# EAGLE design SLG46826G-breakout (EAGLE 9.6.2)
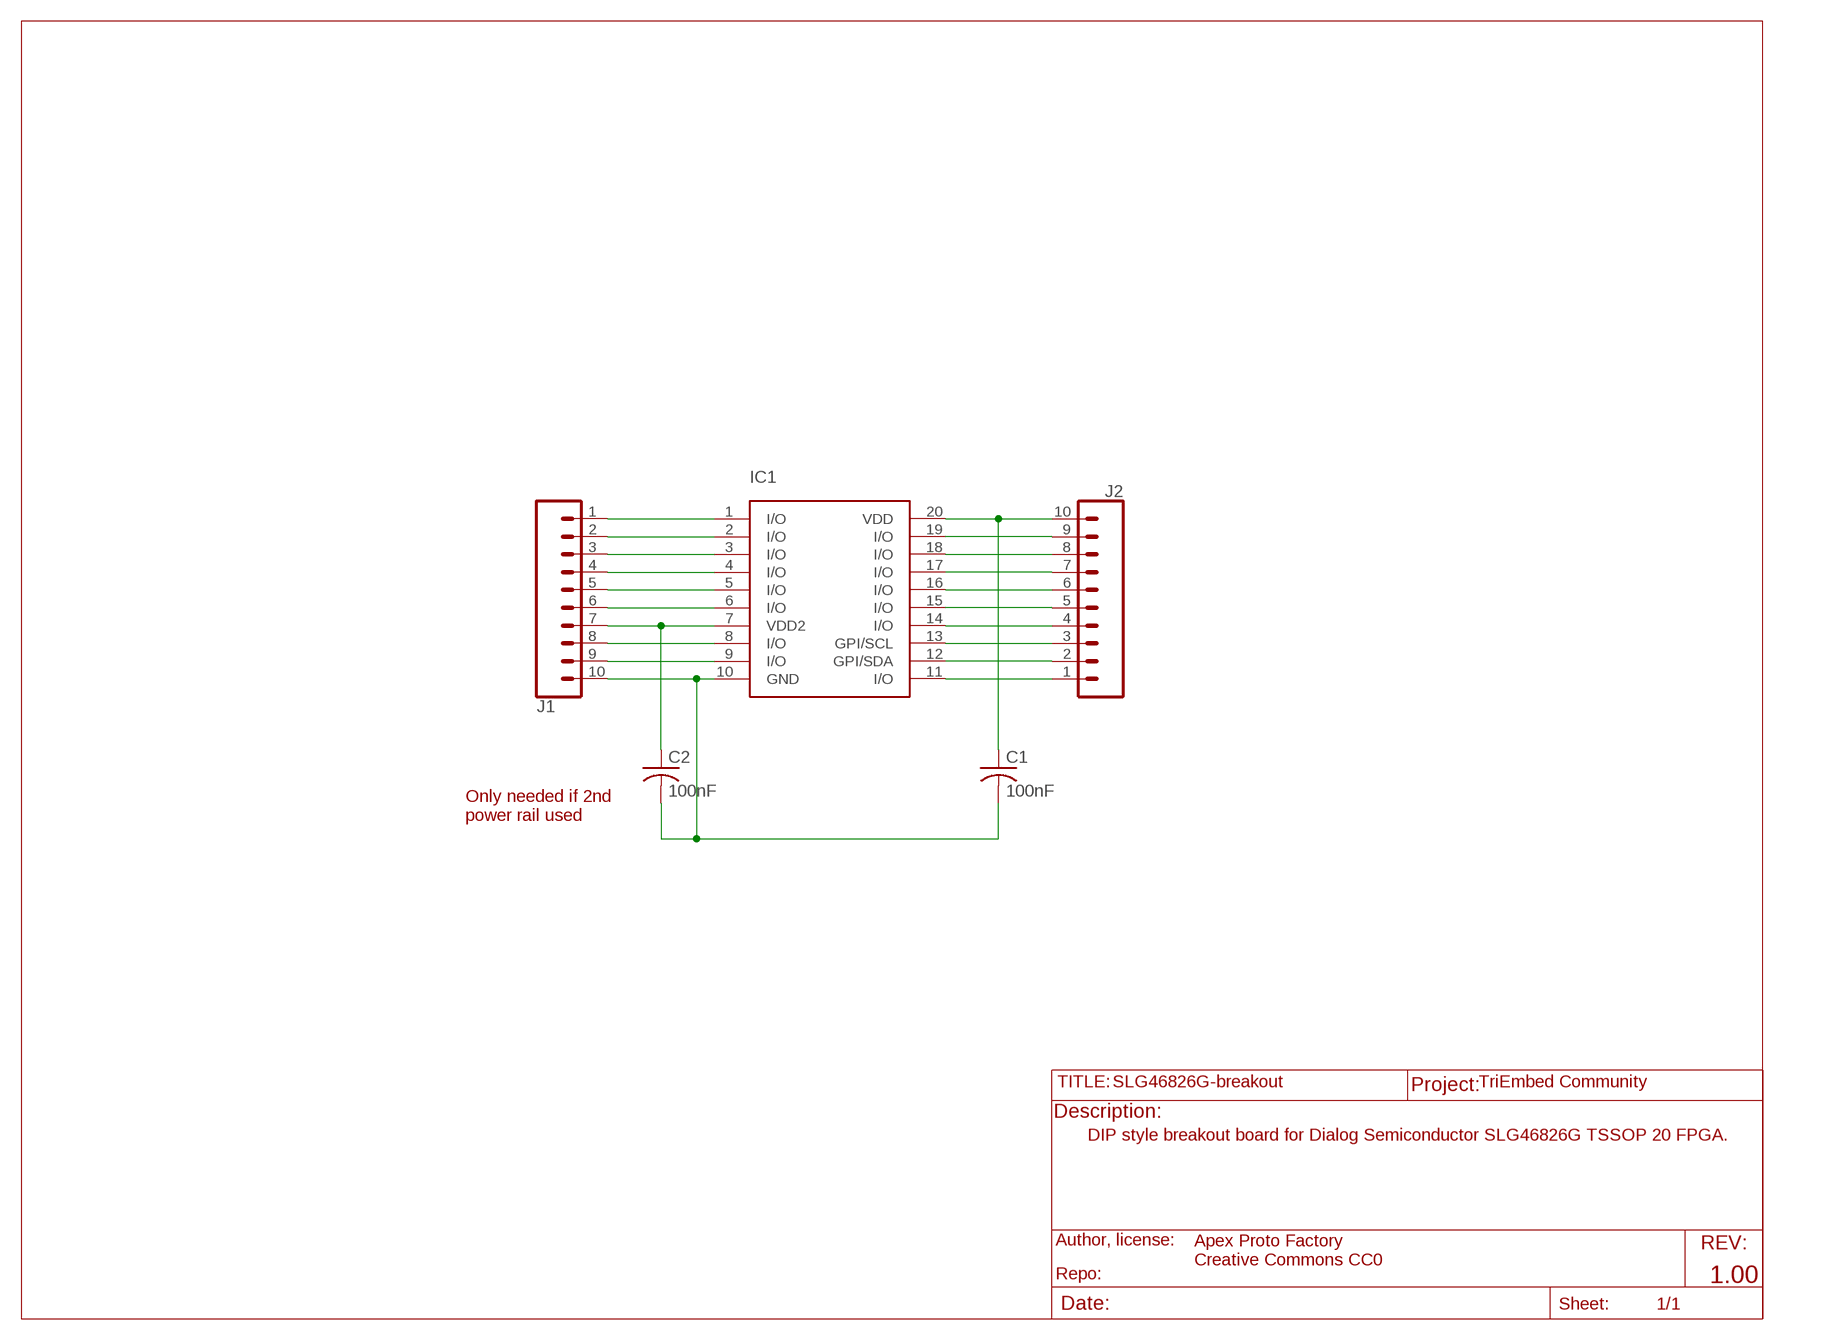
[diagram p0: schematic, sheet 1]

## Parts
C1  100nF  C-USC0805  [C0805]
C2  100nF  C-USC0805  [C0805]
IC1  SLG46826G  [TSOP-20]
J1  CONN_10"  [1X10]
J2  CONN_10"  [1X10]

## Nets
N$1: IC1.1(I/O) J1.1
N$2: IC1.11(I/O) J2.1
N$3: IC1.14(I/O) J2.4
N$4: IC1.2(I/O) J1.2
N$5: IC1.3(I/O) J1.3
N$6: IC1.4(I/O) J1.4
N$7: IC1.5(I/O) J1.5
N$8: IC1.6(I/O) J1.6
N$9: C2.1 IC1.7(VDD2) J1.7
N$10: IC1.8(I/O) J1.8
N$11: IC1.9(I/O) J1.9
N$12: C1.2 C2.2 IC1.10(GND) J1.10
N$13: C1.1 IC1.20(VDD) J2.10
N$14: IC1.19(I/O) J2.9
N$15: IC1.18(I/O) J2.8
N$16: IC1.17(I/O) J2.7
N$17: IC1.16(I/O) J2.6
N$18: IC1.15(I/O) J2.5
N$19: IC1.13(GPI/SCL) J2.3
N$20: IC1.12(GPI/SDA) J2.2

## Notes on the sheet
- Only needed if 2nd
  power rail used
- TriEmbed Community
- DIP style breakout board for Dialog Semiconductor SLG46826G TSSOP 20 FPGA.
- Apex Proto Factory
  Creative Commons CC0
- 1.00

## Library data of the parts
C1 C2 = rcl:C-US: CAPACITOR, American symbol; SPICEPREFIX: C
IC1 = GREENPAK:SLG46826G
J1 J2 = SparkFun-Connectors:CONN_10: Multi connection point. Often used as Generic Header-pin footprint for 0.1 inch spaced/style header connections On any of the 0.1 inch spaced packages, you can populate with these: Break Away Headers - Straight <https://www.sparkfun.com/products/116> (PRT-00116) Break Away Male Headers - Right Angle <https://www.sparkfun.com/products/553> (PRT-00553) Female Headers <https://www.sparkfun.com/products/115> (PRT-00115) Break Away Headers - Machine Pin <https://www.sparkfun.com/products/117> (PRT-00117) Break Away Female Headers - Swiss Machine Pin <https://www.sparkfun.com/products/743> (PRT-00743) Arduino Stackable Header - 10 Pin <https://www.sparkfun.com/products/11376> (PRT-11376) For SCREWTERMINALS and SPRING TERMINALS visit here: Screw Terimnals on SparkFun.com <https://www.sparkfun.com/search/results?term=Screw+Terminals> (5mm/3.5mm/2.54mm spacing) This device is also useful as a general connection point to wire up your design to another part of your project. Our various solder wires solder well into these plated through hole pads. Hook-Up Wire - Assortment (Stranded, 22 AWG) <https://www.sparkfun.com/products/11375> (PRT-11375) Hook-Up Wire - Assortment (Solid Core, 22 AWG) <https://www.sparkfun.com/products/11367> (PRT-11367) View the entire wire category on our website here <https://www.sparkfun.com/categories/141> Special notes: Molex polarized connector foot print use with SKU : PRT-08231 with associated crimp pins and housings. 1MM SMD Version SKU: PRT-10208 NOTES ON THE VARIANTS LOCK and LOCK_LONGPADS... This footprint was designed to help hold the alignment of a through-hole component (i.e. 6-pin header) while soldering it into place. You may notice that each hole has been shifted either up or down by 0.005 of an inch from it's more standard position (which is a perfectly straight line). This slight alteration caused the pins (the squares in the middle) to touch the edges of the holes. Because they are alternating, it causes a "brace" to hold the component in place. 0.005 has proven to be the perfect amount of "off-center" position when using our standard breakaway headers. Although looks a little odd when you look at the bare footprint, once you have a header in there, the alteration is very hard to notice. Also,if you push a header all the way into place, it is covered up entirely on the bottom side.; PROD_ID: CONN-11563

## Board
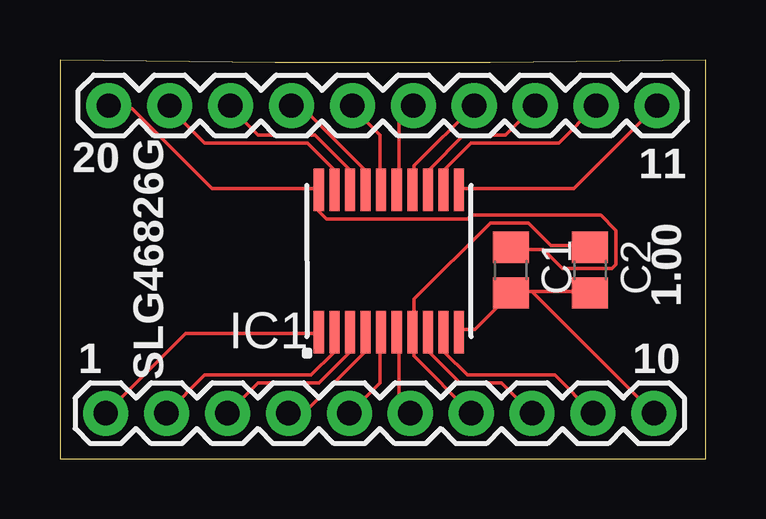
[diagram p1: board, top side]

Size 26.92 x 16.64 mm. Coordinates in mm from the lower left corner, seen from the top.
Outline: 0,0 26.92,0 26.92,16.64 arc-2 0,16.64 0,0
Copper layers (1*16): Top 0.035559375mm / dielectric 1.6mm / Bottom 0.035559375mm
Design rules "oshpark-2layer": minimum track width 6mil, minimum drill 10mil, track to track 6mil, track to pad 6mil, pad to pad 6mil, via to via 6mil, smd to smd 6mil, copper to edge 15mil, drill to drill 6mil, minimum pad ring 5mil, minimum via ring 5mil, stop-mask expansion 2.5mil, vias tented up to drill 0mil, thermal gap 10mil

### Footprints (pad centres in the part's own frame; a part is rotated, then mirrored left to right if it is on the bottom)
C0805 = smd 1.3 x 1.5: 1 -0.95,0; 2 0.95,0
TSOP-20 = smd 0.42 x 1.78: 1 -2.925,-2.97; 2 -2.275,-2.97; 3 -1.625,-2.97; 4 -0.975,-2.97; 5 -0.325,-2.97; 6 0.325,-2.97; 7 0.975,-2.97; 8 1.625,-2.97; 9 2.275,-2.97; 10 2.925,-2.97; 11 2.925,2.97; 12 2.275,2.97; 13 1.625,2.97; 14 0.975,2.97; 15 0.325,2.97; 16 -0.325,2.97; 17 -0.975,2.97; 18 -1.625,2.97; 19 -2.275,2.97; 20 -2.925,2.97
1X10 = drill 1.016 pad 1.88: 1 0,0; 2 2.54,0; 3 5.08,0; 4 7.62,0; 5 10.16,0; 6 12.7,0; 7 15.24,0; 8 17.78,0; 9 20.32,0; 10 22.86,0

### Placement (x,y rotation side)
C1  18.8,7.87 270 top
C2  22.1,7.87 270 top
IC1  13.72,8.26 0 top
J1  1.91,1.91 0 top
J2  24.89,14.73 180 top

### Tracks (layer width: path | path; a pad name or v marks a point on that pad's centre or on a via)
N$1
  Top 0.152: J1.1 5.24,5.24 10.64,5.24 IC1.1
N$2
  Top 0.152: J2.1 21.43,11.27 16.67,11.27 IC1.11
N$3
  Top 0.152: J2.4 14.76,12.22 14.76,11.27 IC1.14
N$4
  Top 0.152: J1.2 6.03,3.49 10.48,3.49 11.43,4.45 11.43,5.24 IC1.2
N$5
  Top 0.152: J1.3 8.26,3.17 10.79,3.17 12.06,4.45 12.06,5.24 IC1.3
N$6
  Top 0.152: J1.4 10.16,1.91 12.7,4.45 12.7,5.24 IC1.4
N$7
  Top 0.152: J1.5 13.34,3.17 13.34,5.24 IC1.5
N$8
  Top 0.152: J1.6 14.13,2.38 14.13,5.24 IC1.6
N$9
  Top 0.152: C2.1 22.07,8.89 20.48,8.89 19.53,9.84 17.94,9.84 14.76,6.67 14.76,5.4 IC1.7 14.76,5.24 14.76,4.29 J1.7
N$10
  Top 0.152: J1.8 18.41,3.17 16.67,3.17 15.4,4.45 15.4,5.24 IC1.8
N$11
  Top 0.152: J1.9 20.64,3.49 16.99,3.49 16.03,4.45 16.03,5.24 IC1.9
N$12
  Top 0.152: 19.68,6.99 22.07,6.99 C2.2 | 19.68,6.99 18.89,6.99 C1.2 18.73,6.83 17.3,5.4 16.67,5.4 IC1.10 | 19.68,6.99 J1.10
N$13
  Top 0.152: C1.1 18.89,8.73 20.16,8.73 20.95,7.94 23.02,7.94 23.18,8.1 23.18,9.53 22.54,10.16 17.14,10.16 16.99,10 11.11,10 10.79,10.32 10.79,11.11 IC1.20 10.64,11.27 6.35,11.27 3.02,14.61 2.06,14.61 J2.10
N$14
  Top 0.152: IC1.19 11.43,11.27 11.43,12.06 10.32,13.18 6.03,13.18 4.6,14.61 J2.9
N$15
  Top 0.152: IC1.18 12.06,11.27 12.06,12.06 10.64,13.49 8.26,13.49 7.14,14.61 J2.8
N$16
  Top 0.152: IC1.17 12.7,11.27 12.7,12.06 10.16,14.61 9.68,14.61 J2.7
N$17
  Top 0.152: IC1.16 13.34,11.27 13.34,13.49 12.22,14.61 J2.6
N$18
  Top 0.152: J2.5 14.13,14.13 14.13,11.27 IC1.15
N$19
  Top 0.152: J2.3 18.57,13.49 16.83,13.49 15.4,12.06 15.4,11.27 IC1.13
N$20
  Top 0.152: J2.2 20.8,13.18 17.14,13.18 16.03,12.06 16.03,11.27 IC1.12

### Text on the board
tNames: 20 | 11 | 1.00 | 1 | 10 | SLG46826G
bNames: GreenPak Breakout / TSSOP20 EG SLG46826G / / TriEmbed 1/2022 / Creative Commons CC0